# EAGLE design CANdiy-Shield_v21 (EAGLE 7.7.0)
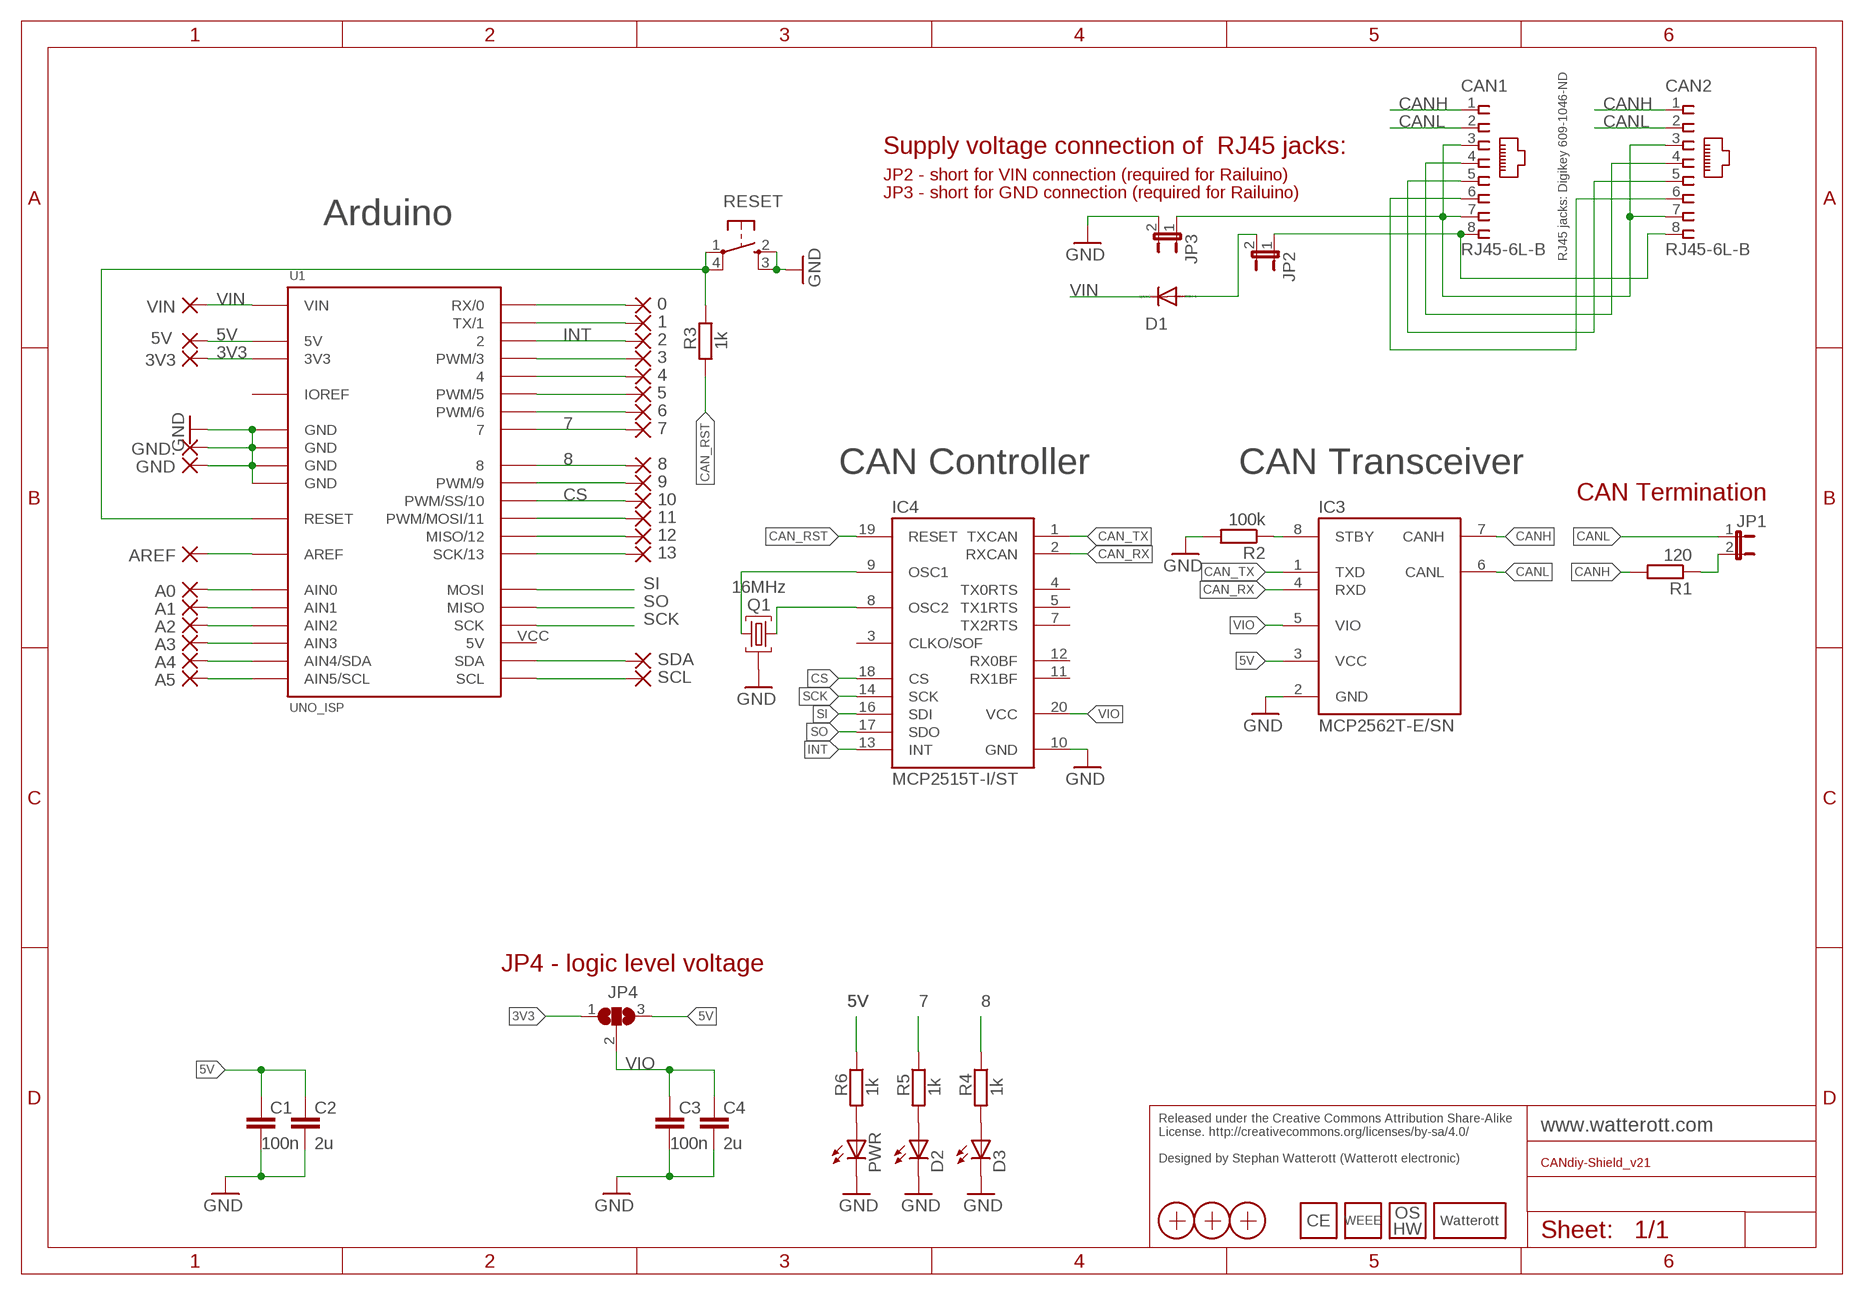
[diagram p0: schematic, sheet 1]

## Parts
0  1,6/0,8  [1,6/0,8]
1  1,6/0,8  [1,6/0,8]
2  1,6/0,8  [1,6/0,8]
3  1,6/0,8  [1,6/0,8]
3V3  1,6/0,8  [1,6/0,8]
4  1,6/0,8  [1,6/0,8]
5  1,6/0,8  [1,6/0,8]
5V  1,6/0,8  [1,6/0,8]
6  1,6/0,8  [1,6/0,8]
7  1,6/0,8  [1,6/0,8]
8  1,6/0,8  [1,6/0,8]
9  1,6/0,8  [1,6/0,8]
10  1,6/0,8  [1,6/0,8]
11  1,6/0,8  [1,6/0,8]
12  1,6/0,8  [1,6/0,8]
13  1,6/0,8  [1,6/0,8]
A0  1,6/0,8  [1,6/0,8]
A1  1,6/0,8  [1,6/0,8]
A2  1,6/0,8  [1,6/0,8]
A3  1,6/0,8  [1,6/0,8]
A4  1,6/0,8  [1,6/0,8]
A5  1,6/0,8  [1,6/0,8]
AREF  1,6/0,8  [1,6/0,8]
C1  100n  C-EUC0603  [C0603]
C2  2u  C-EUC0603  [C0603]
C3  100n  C-EUC0603  [C0603]
C4  2u  C-EUC0603  [C0603]
CAN1  RJ45-6L-B  [RJ45-NO-SHIELD]
CAN2  RJ45-6L-B  [RJ45-NO-SHIELD]
D1  CGRM4001-G  [SOD-123_MINI-SMA]
D2  LEDCHIPLED_0603  [CHIPLED_0603]
D3  LEDCHIPLED_0603  [CHIPLED_0603]
GND  1,6/0,8  [1,6/0,8]
GND.  1,6/0,8  [1,6/0,8]
IC3  MCP2562T-E/SN  [SO08]
IC4  MCP2515T-I/ST  [TSSOP20]
JP1  JP1E  [JP1]
JP2  JP1E  [JP1]
JP3  JP1E  [JP1]
JP4  SJ2W  [SJ_2]
LOGO3  LOGO-9  [LOGO_9MM]
LOGO4  LOGO_CE-2  [CE_2MM]
LOGO5  LOGO_OSHW-3  [OSHW_3MM]
LOGO6  LOGO_WEEE-4  [WEEE_4MM]
PWR  LEDCHIPLED_0603  [CHIPLED_0603]
Q1  16MHz  CRYSTAL-RES-32  [CRYSTAL_32X13]
R1  120  R-EU_R0603  [R0603]
R2  100k  R-EU_R0603  [R0603]
R3  1k  R-EU_R0603  [R0603]
R4  1k  R-EU_R0603  [R0603]
R5  1k  R-EU_R0603  [R0603]
R6  1k  R-EU_R0603  [R0603]
RESET  SW_SMDS  [SW_SMD4]
SCL  1,6/0,8  [1,6/0,8]
SDA  1,6/0,8  [1,6/0,8]
U1  UNO_ISP  [UNO_ISP]
VIN  1,6/0,8  [1,6/0,8]
X1  PASSER-07  [PASSER_07MM]
X2  PASSER-07  [PASSER_07MM]
X3  PASSER-07  [PASSER_07MM]

## Nets
0: 0.1(P) U1.0(RX/0)
1: 1.1(P) U1.1(TX/1)
3: 3.1(P) U1.3(PWM/3)
3V3: 3V3.1(P) JP4.1 U1.3V3
4: 4.1(P) U1.4
5: 5.1(P) U1.5(PWM/5)
5V: 5V.1(P) C1.1 C2.1 IC3.3(VCC) JP4.3 R6.1 U1.5V
6: 6.1(P) U1.6(PWM/6)
7: 7.1(P) R5.1 U1.7
8: 8.1(P) R4.1 U1.8
9: 9.1(P) U1.9(PWM/9)
11: 11.1(P) U1.11(PWM/MOSI/11)
12: 12.1(P) U1.12(MISO/12)
13: 13.1(P) U1.13(SCK/13)
A0: A0.1(P) U1.AIN0
A1: A1.1(P) U1.AIN1
A2: A2.1(P) U1.AIN2
A3: A3.1(P) U1.AIN3
A4: A4.1(P) U1.AIN4(AIN4/SDA)
A5: A5.1(P) U1.AIN5(AIN5/SCL)
AREF: AREF.1(P) U1.AREF
CAN_RST: IC4.19(RESET) R3.2
CAN_RX: IC3.4(RXD) IC4.2(RXCAN)
CAN_TX: IC3.1(TXD) IC4.1(TXCAN)
CANH: CAN1.1 CAN2.1 IC3.7(CANH) R1.2
CANL: CAN1.2 CAN2.2 IC3.6(CANL) JP1.1
CS: 10.1(P) IC4.18(CS) U1.10(PWM/SS/10)
GND: C1.2 C2.2 C3.2 C4.2 D2.C D3.C GND.1(P) GND..1(P) IC3.2(GND) IC4.10(GND) JP3.2 PWR.C Q1.GND R2.2 RESET.2(S) RESET.3(S1) U1.GND@1(GND) U1.GND@2(GND) U1.GND@3(GND) U1.GND@4(GND)
INT: 2.1(P) IC4.13(INT) U1.2
N$6: CAN1.8 CAN2.8 JP2.1
N$7: IC3.8(STBY) R2.1
N$8: CAN1.3 CAN1.7 CAN2.3 CAN2.7 JP3.1
N$9: JP1.2 R1.1
N$18: SCL.1(P) U1.SCL
N$19: SDA.1(P) U1.SDA
N$21: D3.A R4.2
N$22: PWR.A R6.2
N$23: D2.A R5.2
N$121: D1.A JP2.2
N$199: CAN1.4 CAN2.4
N$200: CAN1.5 CAN2.5
N$201: CAN1.6 CAN2.6
OSC1: IC4.9(OSC1) Q1.2
OSC2: IC4.8(OSC2) Q1.1
RESET: R3.1 RESET.1(P) RESET.4(P1) U1.RST(RESET)
SCK: IC4.14(SCK) U1.SCK
SI: IC4.16(SDI) U1.MOSI
SO: IC4.17(SDO) U1.MISO
VIN: D1.C U1.VIN VIN.1(P)
VIO: C3.1 C4.1 IC3.5(VIO) IC4.20(VCC) JP4.2
Unconnected: IC4.3(CLKO/SOF) IC4.4(TX0RTS) IC4.5(TX1RTS) IC4.7(TX2RTS) IC4.11(RX1BF) IC4.12(RX0BF) U1.VCC(5V)

## Notes on the sheet
- Supply voltage connection of  RJ45 jacks:
- JP2 - short for VIN connection (required for Railuino)
- JP3 - short for GND connection (required for Railuino)
- Arduino
- RJ45 jacks: Digikey 609-1046-ND
- CAN Controller | CAN Transceiver
- CAN Termination
- JP4 - logic level voltage
- Released under the Creative Commons Attribution Share-Alike 
  License. http://creativecommons.org/licenses/by-sa/4.0/
  
  Designed by Stephan Watterott (Watterott electronic)

## Power pins joined to a net without a drawn wire
IOREF: U1.IOREF

## Library data of the parts
0 1-3 3V3 4 5 5V 6-13 A0 A1-A5 AREF GND GND. SCL SDA VIN = wirepad:1,6/0,8: THROUGH-HOLE PAD
C1-C4 = resistor:C-EU: CAPACITOR, European symbol
CAN1 CAN2 = con-tycoelectronics:RJ45: CORCOM Modular RJ Jacks No Shield Source: www.tycoelectronics.com .. ENG_DS_1654001_1099_RJ_L_0507.pdf; MPN: RJ45-6L-B; OC_FARNELL: unknown; OC_NEWARK: 16R6090
D1 = diode:CGRM400*-G: Molded plasitc,JEDEC SOD-123/Mini SMA Source: Comchip CGRM4001-G.pdf
D2 D3 PWR = led:LED: LED OSRAM: - CHIPLED LG R971, LG N971, LY N971, LG Q971, LY Q971, LO R971, LY R971 LH N974, LH R974 LS Q976, LO Q976, LY Q976 LO Q996 - Hyper CHIPLED LW Q18S LB Q993, LB Q99A, LB R99A - SideLED LS A670, LO A670, LY A670, LG A670, LP A670 LB A673, LV A673, LT A673, LW A673 LH A674 LY A675 LS A676, LA A676, LO A676, LY A676, LW A676 LS A679, LY A679, LG A679 - Hyper Micro SIDELED® LS Y876, LA Y876, LO Y876, LY Y876 LT Y87S - SmartLED LW L88C, LW L88S LB L89C, LB L89S, LG L890 LS L89K, LO L89K, LY L89K LS L896, LA L896, LO L896, LY L896 - TOPLED LS T670, LO T670, LY T670, LG T670, LP T670 LSG T670, LSP T670, LSY T670, LOP T670, LYG T670 LG T671, LOG T671, LSG T671 LB T673, LV T673, LT T673, LW T673 LH T674 LS T676, LA T676, LO T676, LY T676, LB T676, LH T676, LSB T676, LW T676 LB T67C, LV T67C, LT T67C, LS T67K, LO T67K, LY T67K, LW E67C LS E67B, LA E67B, LO E67B, LY E67B, LB E67C, LV E67C, LT E67C LW T67C LS T679, LY T679, LG T679 LS T770, LO T770, LY T770, LG T770, LP T770 LB T773, LV T773, LT T773, LW T773 LH T774 LS E675, LA E675, LY E675, LS T675 LS T776, LA T776, LO T776, LY T776, LB T776 LHGB T686 LT T68C, LB T68C - Hyper Mini TOPLED® LB M676 - Mini TOPLED Santana® LG M470 LS M47K, LO M47K, LY M47K Source: http://www.osram.convergy.de LUXEON: - LUMILED® LXK2-PW12-R00, LXK2-PW12-S00, LXK2-PW14-U00, LXK2-PW14-V00 LXK2-PM12-R00, LXK2-PM12-S00, LXK2-PM14-U00 LXK2-PE12-Q00, LXK2-PE12-R00, LXK2-PE12-S00, LXK2-PE14-T00, LXK2-PE14-U00 LXK2-PB12-K00, LXK2-PB12-L00, LXK2-PB12-M00, LXK2-PB14-N00, LXK2-PB14-P00, LXK2-PB14-Q00 LXK2-PR12-L00, LXK2-PR12-M00, LXK2-PR14-Q00, LXK2-PR14-R00 LXK2-PD12-Q00, LXK2-PD12-R00, LXK2-PD12-S00 LXK2-PH12-R00, LXK2-PH12-S00 LXK2-PL12-P00, LXK2-PL12-Q00, LXK2-PL12-R00 Source: www.luxeon.com KINGBRIGHT: KA-3528ASYC Source: www.kingbright.com
IC3 = we-chip:MCP2562: Microchip MCP2562/MCP2562FD CAN Transceiver
IC4 = we-chip:MCP2515: Microchip MCP2515 CAN Controller
JP1-JP3 = jumper:JP1E: JUMPER
JP4 = jumper:SJ2W: SMD solder JUMPER
LOGO3 = we-symbol:LOGO: Watterott electronic Logo
LOGO4 = we-symbol:LOGO_CE: CE Logo
LOGO5 = we-symbol:LOGO_OSHW: Open-Source-Hardware Logo
LOGO6 = we-symbol:LOGO_WEEE: WEEE Logo
Q1 = we-rcl:CRYSTAL-RES: Crystal Resonator Murata CSTCR (Size: 4.5mm x 2.0mm) Tolerance: 0.5% 4MHz 15pF CST-CR-4M00-G53 4MHz 39pF CST-CR-4M00-G55 Tolerance: 0.1% 4MHz 39pF CST-CR-4M00-G15 Murata CSTE (Size: 3.2mm x 1.3mm) Tolerance: 0.5% 8MHz 33pF CST-CE-8M00-G55 12MHz 33pF CST-CE-12M0-G55 16MHz 15pF CST-CE-16M0-V53 20MHz 15pF CST-CE-20M0-V53 Tolerance: 0.1% 8MHz 33pF CST-CE-8M00-G15 12MHz 33pF CST-CE-12M0-G15 16MHz 15pF CST-CE-16M0-V13 20MHz 15pF CST-CE-20M0-V13
R1 R2 = resistor:R-EU_: RESISTOR, European symbol
R3-R6 = rcl:R-EU_: RESISTOR, European symbol
RESET = Switch-SMD:SW_SMD
U1 = Arduino:UNO_ISP
X1-X3 = we-symbol:PASSER: Fiducial Marker

## Board
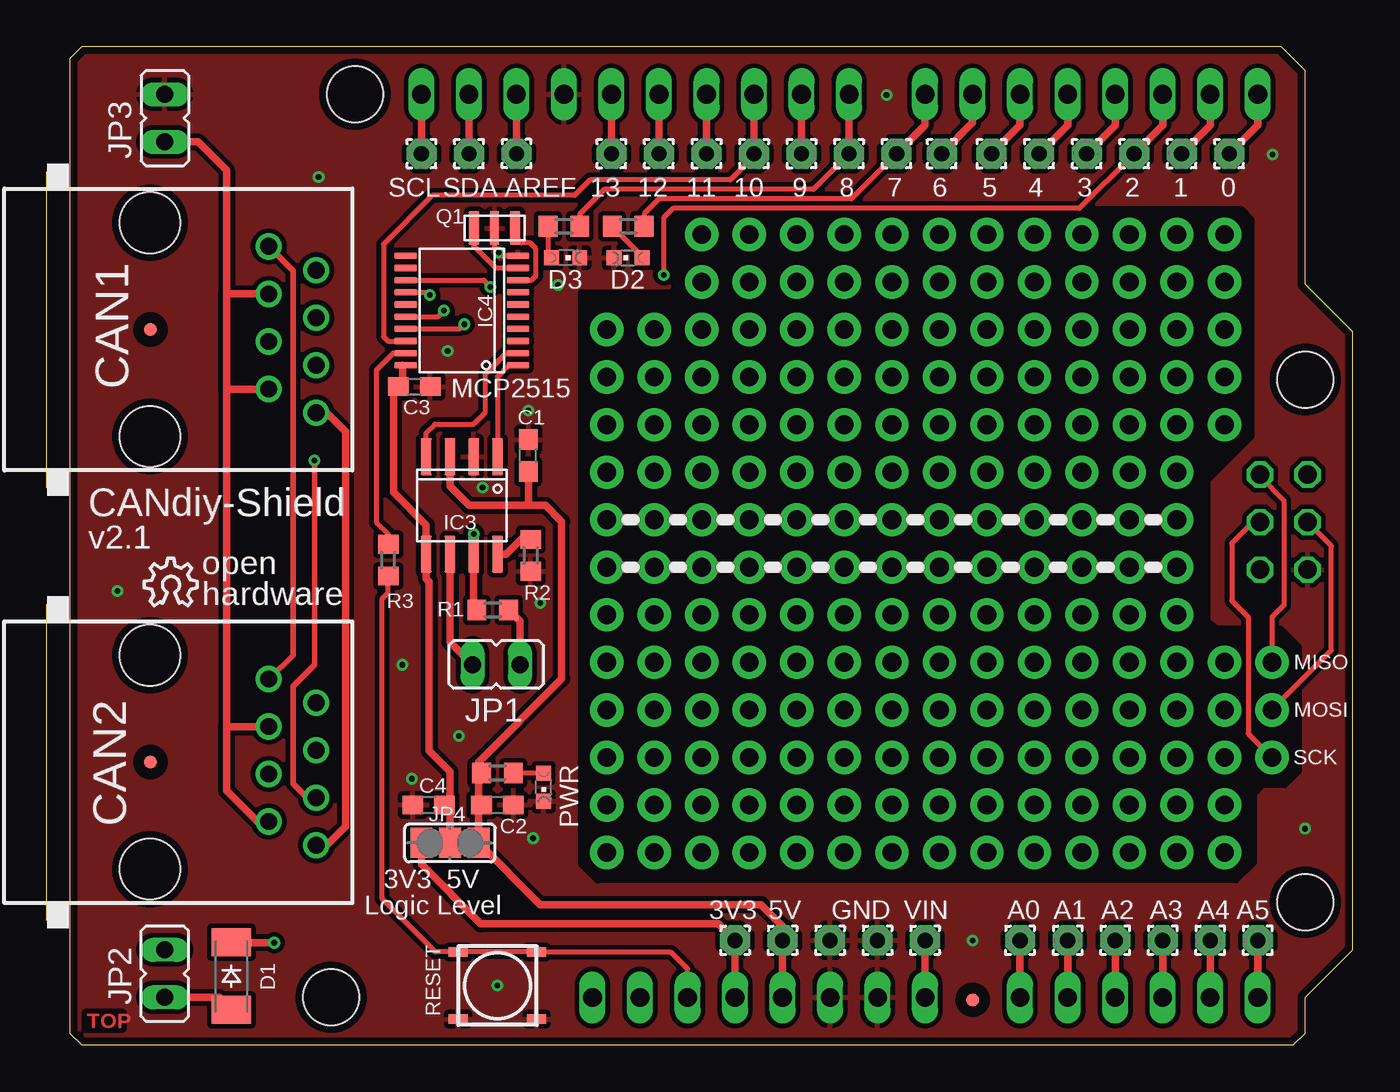
[diagram p1: board, top side]
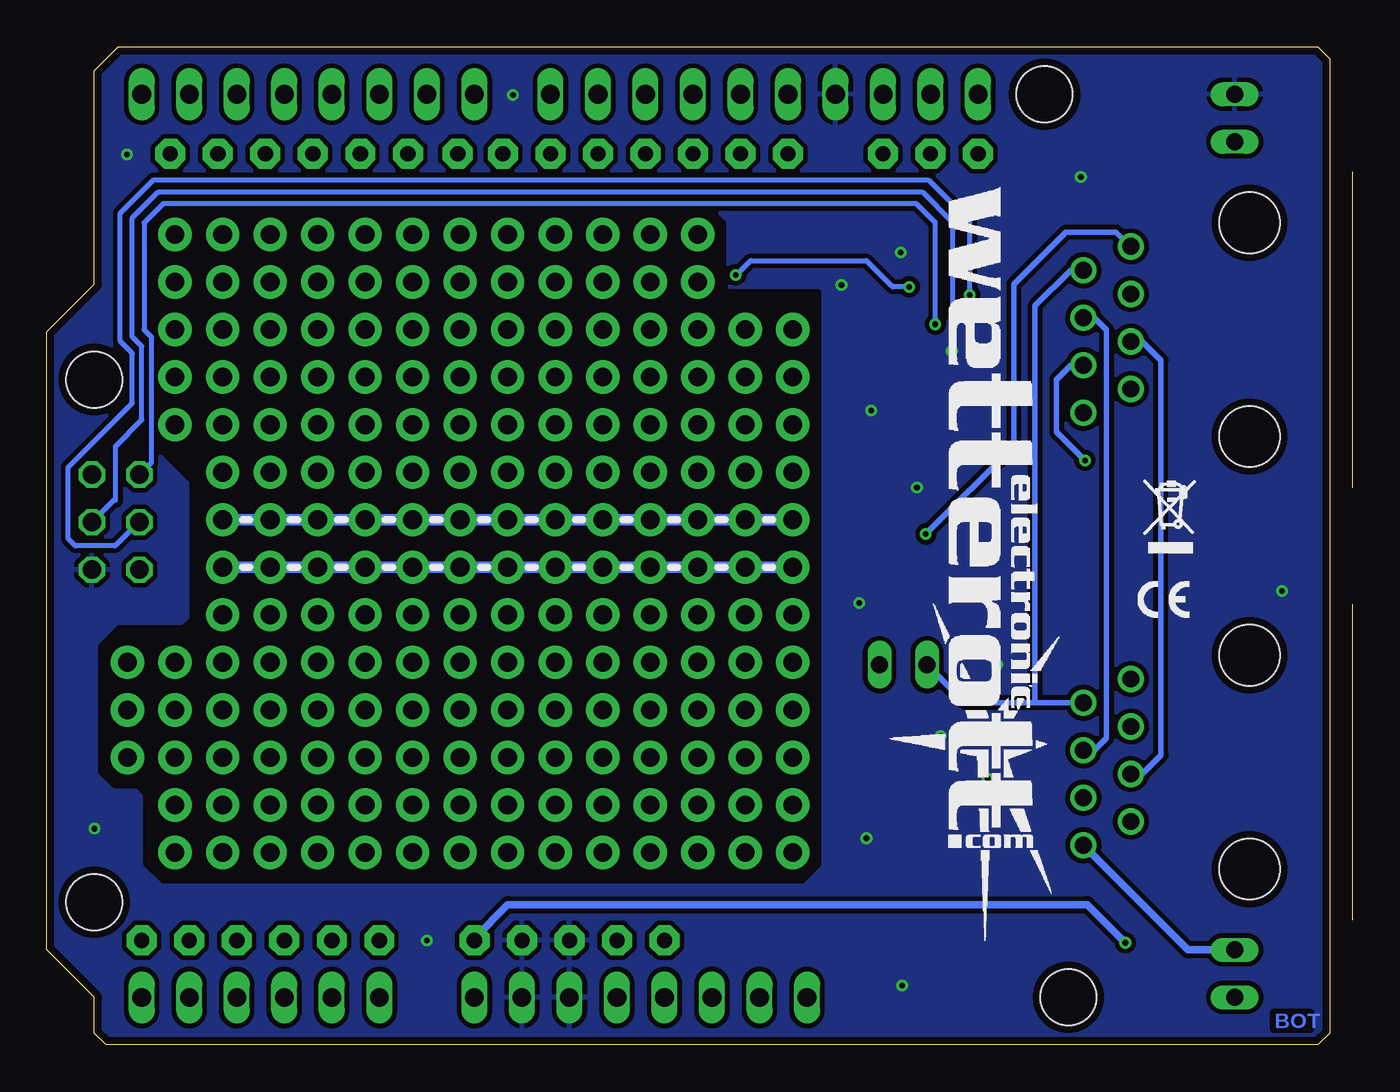
[diagram p2: board, bottom side, seen from below]

Size 69.81 x 53.34 mm. Coordinates in mm from the lower left corner, seen from the top.
Copper layers (1*16): Top 0.035mm / dielectric 1.5mm / Bottom 0.035mm
Design rules "we-dru-2-layer": minimum track width 0.15mm, minimum drill 0.3mm, track to track 0.15mm, track to pad 0.15mm, pad to pad 0.15mm, via to via 0.15mm, smd to smd 0.1mm, copper to edge 0.4mm, drill to drill 0.2mm, minimum pad ring 0.18mm, minimum via ring 0.16mm, stop-mask expansion 0.1mm, vias tented up to drill 0.5mm, thermal gap 0.25mm

### Footprints (pad centres in the part's own frame; a part is rotated, then mirrored left to right if it is on the bottom)
1,6/0,8 = drill 0.813 pad 1.6 octagon: 1 0,0
C0603 = smd 1.1 x 1: 1 -0.85,0; 2 0.85,0
RJ45-NO-SHIELD = drill 0.9 pad 1.4: 1 -4.445,6.35; 2 -3.175,8.89; 3 -1.905,6.35; 4 -0.635,8.89; 5 0.635,6.35; 6 1.905,8.89; 7 3.175,6.35; 8 4.445,8.89 | hole 3.251: -5.715,0; 5.715,0
SOD-123_MINI-SMA = smd 1.5 x 2.1: A 1.8,0; C -1.8,0
CHIPLED_0603 = smd 0.8 x 0.8: A 0,-0.75; C 0,0.75
SO08 = smd 2 x 0.6: 1 -2.6,1.905; 2 -2.6,0.635; 3 -2.6,-0.635; 4 -2.6,-1.905; 5 2.6,-1.905; 6 2.6,-0.635; 7 2.6,0.635; 8 2.6,1.905
TSSOP20 = smd 1.2 x 0.35: 1 -3,2.925; 2 -3,2.275; 3 -3,1.625; 4 -3,0.975; 5 -3,0.325; 6 -3,-0.325; 7 -3,-0.975; 8 -3,-1.625; 9 -3,-2.275; 10 -3,-2.925; 11 3,-2.925; 12 3,-2.275; 13 3,-1.625; 14 3,-0.975; 15 3,-0.325; 16 3,0.325; 17 3,0.975; 18 3,1.625; 19 3,2.275; 20 3,2.925
JP1 = drill 0.914 long: 1 0,-1.27; 2 0,1.27
SJ_2 = smd 1.168 x 1.6: 1 -1.524,0; 2 0,0; 3 1.524,0
CRYSTAL_32X13 = smd 1.8 x 0.6: 1 0,1.1; 2 0,-1.1 | smd 1.8 x 0.5: GND 0,0
R0603 = smd 1 x 1.1: 1 -0.85,0; 2 0.85,0
SW_SMD4 = smd 0.508 x 1.016: 1 -1.8,-2.1; 2 1.8,-2.1; 3 1.8,2.1; 4 -1.8,2.1
UNO_ISP = drill 1 long: 0 63.5,50.8; 1 60.96,50.8; 2 58.42,50.8; 3 55.88,50.8; 3V3 35.56,2.54; 4 53.34,50.8; 5 50.8,50.8; 5V 38.1,2.54; 6 48.26,50.8; 7 45.72,50.8; 8 41.656,50.8; 9 39.116,50.8; 10 36.576,50.8; 11 34.036,50.8; 12 31.496,50.8; 13 28.956,50.8; AIN0 50.8,2.54; AIN1 53.34,2.54; AIN2 55.88,2.54; AIN3 58.42,2.54; AIN4 60.96,2.54; AIN5 63.5,2.54; AREF 23.876,50.8; GND@1 40.64,2.54; GND@2 43.18,2.54; GND@3 26.416,50.8; IOREF 30.48,2.54; NC 27.94,2.54; RST 33.02,2.54; SCL 18.796,50.8; SDA 21.336,50.8; VIN 45.72,2.54 | drill 1 octagon: GND@4 66.167,25.4; MISO 63.627,30.48; MOSI 66.167,27.94; RST2 63.627,25.4; SCK 63.627,27.94; VCC 66.167,30.48 | hole 3: 66.04,35.56; 66.04,7.62; 15.24,50.8; 13.97,2.54
PASSER_07MM = smd 0.7 x 0.7: X 0,0

### Placement (x,y rotation side)
0  63.21,47.62 180 top
1  60.67,47.62 180 top
2  58.13,47.62 180 top
3  55.59,47.62 180 top
3V3  36.79,5.59 0 top
4  53.05,47.62 180 top
5  50.51,47.62 180 top
5V  39.33,5.59 0 top
6  47.84,47.62 180 top
7  45.43,47.62 180 top
8  42.89,47.62 180 top
9  40.35,47.62 180 top
10  37.81,47.62 180 top
11  35.27,47.62 180 top
12  32.73,47.62 180 top
13  30.19,47.62 180 top
A0  52.03,5.59 0 top
A1  54.57,5.59 0 top
A2  57.11,5.59 0 top
A3  59.65,5.59 0 top
A4  62.19,5.59 0 top
A5  64.73,5.59 0 top
AREF  25.11,47.62 0 top
C1  25.74,31.5 90 top
C2  24.09,12.83 0 top
C3  19.65,35.18 0 top
C4  20.41,12.83 180 top
CAN1  5.51,38.23 270 top
CAN2  5.51,15.11 270 top
D1  9.87,3.68 270 top
D2  31.08,42.07 90 top
D3  27.74,42.07 270 top
GND  41.87,5.59 0 top
GND.  44.41,5.59 0 top
IC3  22.19,28.83 270 top
IC4  22.19,39.24 180 top
JP1  24.03,20.32 270 top
JP2  6.31,3.81 180 top
JP3  6.31,49.53 0 top
JP4  21.55,10.79 0 top
LOGO3  24.73,45.72 270 bottom
LOGO4  10.12,23.81 0 bottom
LOGO5  6.63,24.77 0 top
LOGO6  9.8,28.26 0 bottom
PWR  26.57,13.78 180 top
Q1  23.93,43.66 270 top
R1  23.84,23.24 180 top
R2  25.87,26.16 270 top
R3  18.25,25.91 90 top
R4  27.65,43.75 180 top
R5  31.08,43.75 180 top
R6  24.09,14.54 0 top
RESET  24.09,3.17 270 top
SCL  20.03,47.62 180 top
SDA  22.57,47.62 180 top
U1  1.23,0 0 top
VIN  46.95,5.59 0 top
X1  5.55,15.11 0 top
X2  5.55,38.23 0 top
X3  49.49,2.41 0 top

### Tracks (layer width: path | path; a pad name or v marks a point on that pad's centre or on a via)
0
  Top 0.406: U1.0 64.73,49.15 0.1
1
  Top 0.406: U1.1 62.19,49.15 1.1
3
  Top 0.406: U1.3 57.11,49.15 3.1
3V3
  Top 0.406: U1.3V3 3V3.1 35.9,6.48 23.2,6.48 20.03,9.65 JP4.1
4
  Top 0.406: U1.4 54.57,49.15 4.1
5
  Top 0.406: U1.5 52.03,49.15 5.1
5V
  Top 0.254: 23.08,12.66 C2.1 23.08,12.83 | 23.08,14.38 R6.1 23.14,14.54 23.08,14.61
  Top 0.406: U1.5V 5V.1 39.33,6.35 38.19,7.49 26.38,7.49 JP4.3 23.08,12.66 | 25.74,28.83 22.57,28.83 21.55,29.84 IC3.3 | 25.74,28.83 26.66,28.83 27.52,27.97 27.52,19.56 23.08,15.11 23.08,14.61 | C1.1 25.74,28.83 | 23.08,12.83 23.08,14.38
6
  Top 0.406: U1.6 49.49,49.28 6.1
7
  Top 0.254: 7.1 43.01,45.21 32.73,45.21 31.93,44.41 R5.1
  Top 0.406: U1.7 46.95,49.15 7.1
8
  Top 0.254: 8.1 40.98,45.72 29.81,45.72 28.5,44.41 R4.1
  Top 0.406: U1.8 8.1
9
  Top 0.406: U1.9 9.1
11
  Top 0.406: 11.1 U1.11
12
  Top 0.406: 12.1 U1.12
13
  Top 0.406: 13.1 U1.13
A0
  Top 0.406: U1.AIN0 A0.1
A1
  Top 0.406: U1.AIN1 A1.1
A2
  Top 0.406: U1.AIN2 A2.1
A3
  Top 0.406: U1.AIN3 A3.1
A4
  Top 0.406: U1.AIN4 A4.1
A5
  Top 0.406: U1.AIN5 A5.1
AREF
  Top 0.406: AREF.1 U1.AREF
CAN_RST
  Top 0.254: R3.2 18.25,27.3 17.61,27.94 17.61,36.07 18.51,36.97 IC4.19
CAN_RX
  Top 0.254: IC4.2 24.55,36.97 23.46,35.88 23.46,33.81 22.82,33.18 20.76,33.18 20.28,32.7 IC3.4
CAN_TX
  Top 0.254: IC3.1 24.09,35.72 24.69,36.32 IC4.1
CANH  (via drill 0.3)
  Top 0.254: CAN2.1 11.9,19.56 | IC3.7 v22.82,27.3
  Top 0.305: 22.82,23.41 R1.2 | 11.9,19.56 13.17,20.83 13.17,41.36 CAN1.1
  Top 0.406: IC3.7 22.82,23.41
  Bottom 0.254: CAN1.1 11.9,42.67
  Bottom 0.305: 11.9,42.67 12.66,43.43 15.33,43.43 18.12,40.64 18.12,32 v22.82,27.3
CANL
  Top 0.406: JP1.1 21.55,21.53 IC3.6
  Bottom 0.305: CAN2.2 16.98,18.29 | 16.98,18.29 20.73,18.29 JP1.1 | CAN1.2 15.07,41.4 16.98,39.5 16.98,18.29
CS
  Top 0.254: 10.1 37.81,47.5 36.54,46.23 29.04,46.23 28.22,45.4 20.6,45.4 18,42.8 18,37.85 18.25,37.59 19.21,37.59 | 19.24,37.59 19.21,37.59 | 19.21,37.59 IC4.18
  Top 0.406: U1.10 10.1
GND  (via drill 0.3)
  Top 0.254: IC4.10 24.34,42.17 v24.16,42.35 23.93,42.58 Q1.GND
  other vias: 23.3,29.78 21.42,37.08 24.09,3.17 26.38,23.62 25.74,33.91 67.27,11.56 19.52,14.22 26,11.05 3.77,24.26 49.49,5.59 65.53,47.59 14.54,46.39 44.89,50.77 27.33,40.61 19.01,20.32 22.03,16.51
  pour Bottom (isolate 0.254): 1.23,53.34 69.81,53.34 69.81,0 1.23,0
  pour Top (isolate 0.254): 1.23,0 1.23,53.34 69.81,53.34 69.81,0
INT  (via drill 0.3)
  Top 0.254: 2.1 55.21,44.7 33.49,44.7 32.98,44.2 v32.98,41.15 | v23.71,40.51 23.36,40.87 IC4.13
  Top 0.406: U1.2 59.65,49.15 2.1
  Bottom 0.254: v32.98,41.15 32.95,41.15 32.19,41.91 26,41.91 24.6,40.51 v23.71,40.51
N$2  (via drill 1 pad 1.78)
  other vias: 32.47,15.37
N$3  (via drill 1 pad 1.78)
  other vias: 29.93,15.37
N$4  (via drill 1 pad 1.78)
  other vias: 32.47,12.83
N$5  (via drill 1 pad 1.78)
  other vias: 29.93,12.83
N$6
  Top 0.406: CAN2.8 14.95,10.67 15.96,11.68 15.96,32.77 14.95,33.78 CAN1.8
  Bottom 0.406: JP2.1 8.81,5.08 CAN2.8
N$7
  Top 0.406: R2.1 25.35,27.01 24.56,26.23 IC3.8
N$8
  Top 0.406: JP3.1 8.09,48.26 9.61,46.74 9.61,40.13 | 9.61,40.13 CAN1.3 | 9.61,35.05 9.61,40.13 | CAN1.7 9.61,35.05 | 9.61,35.05 9.61,17.02 | 9.61,17.02 CAN2.3 | CAN2.7 11.26,11.94 9.61,13.59 9.61,17.02
N$9
  Top 0.406: JP1.2 25.3,22.63 R1.1
N$10  (via drill 1 pad 1.78)
  other vias: 60.41,35.69
N$11  (via drill 1 pad 1.78)
  other vias: 57.87,35.69
N$12  (via drill 1 pad 1.78)
  other vias: 55.33,35.69
N$14  (via drill 1 pad 1.78)
  other vias: 52.79,35.69
N$15  (via drill 1 pad 1.78)
  other vias: 50.25,35.69
N$16  (via drill 1 pad 1.78)
  other vias: 47.71,35.69
N$17  (via drill 1 pad 1.78)
  other vias: 45.17,35.69
N$18
  Top 0.406: SCL.1 U1.SCL
N$19
  Top 0.406: SDA.1 U1.SDA
N$20  (via drill 1 pad 1.78)
  other vias: 42.63,38.23
N$21
  Top 0.254: R4.2 26.8,42.26 D3.A
N$22
  Top 0.254: R6.2 26.56,14.54 PWR.A
N$23
  Top 0.254: D2.A 31.83,42.15 R5.2
N$24  (via drill 1 pad 1.78)
  other vias: 42.63,10.29
N$25  (via drill 1 pad 1.78)
  other vias: 42.63,35.69
N$26  (via drill 1 pad 1.78)
  other vias: 62.95,38.23
N$27  (via drill 1 pad 1.78)
  other vias: 60.41,38.23
N$28  (via drill 1 pad 1.78)
  other vias: 57.87,38.23
N$29  (via drill 1 pad 1.78)
  other vias: 55.33,38.23
N$30  (via drill 1 pad 1.78)
  other vias: 52.79,38.23
N$31  (via drill 1 pad 1.78)
  other vias: 50.25,38.23
N$32  (via drill 1 pad 1.78)
  other vias: 47.71,38.23
N$33  (via drill 1 pad 1.78)
  other vias: 45.17,38.23
N$34  (via drill 1 pad 1.78)
  other vias: 42.63,33.15
N$35  (via drill 1 pad 1.78)
  other vias: 42.63,30.61
N$37  (via drill 1 pad 1.78)
  other vias: 62.95,40.77
N$38  (via drill 1 pad 1.78)
  other vias: 60.41,40.77
N$39  (via drill 1 pad 1.78)
  other vias: 57.87,40.77
N$40  (via drill 1 pad 1.78)
  other vias: 55.33,40.77
N$41  (via drill 1 pad 1.78)
  other vias: 62.95,20.45
N$42  (via drill 1 pad 1.78)
  other vias: 62.95,10.29
N$43  (via drill 1 pad 1.78)
  other vias: 60.41,10.29
N$44  (via drill 1 pad 1.78)
  other vias: 57.87,10.29
N$45  (via drill 1 pad 1.78)
  other vias: 55.33,10.29
N$46  (via drill 1 pad 1.78)
  other vias: 52.79,10.29
N$47  (via drill 1 pad 1.78)
  other vias: 50.25,10.29
N$48  (via drill 1 pad 1.78)
  other vias: 47.71,10.29
N$49  (via drill 1 pad 1.78)
  other vias: 45.17,10.29
N$50  (via drill 1 pad 1.78)
  other vias: 52.79,40.77
N$51  (via drill 1 pad 1.78)
  other vias: 50.25,40.77
N$52  (via drill 1 pad 1.78)
  other vias: 47.71,40.77
N$53  (via drill 1 pad 1.78)
  other vias: 45.17,40.77
N$55  (via drill 1 pad 1.78)
  other vias: 62.95,43.31
N$56  (via drill 1 pad 1.78)
  other vias: 60.41,43.31
N$57  (via drill 1 pad 1.78)
  other vias: 57.87,43.31
N$58  (via drill 1 pad 1.78)
  other vias: 55.33,43.31
N$59  (via drill 1 pad 1.78)
  other vias: 60.41,33.15
N$60  (via drill 1 pad 1.78)
  other vias: 57.87,33.15
N$61  (via drill 1 pad 1.78)
  other vias: 55.33,33.15
N$62  (via drill 1 pad 1.78)
  other vias: 52.79,33.15
N$63  (via drill 1 pad 1.78)
  other vias: 50.25,33.15
N$64  (via drill 1 pad 1.78)
  other vias: 47.71,33.15
N$65  (via drill 1 pad 1.78)
  other vias: 45.17,33.15
N$66  (via drill 1 pad 1.78)
  other vias: 52.79,43.31
N$67  (via drill 1 pad 1.78)
  other vias: 50.25,43.31
N$68  (via drill 1 pad 1.78)
  other vias: 47.71,43.31
N$69  (via drill 1 pad 1.78)
  other vias: 45.17,43.31
N$70  (via drill 1 pad 1.78)
  other vias: 42.63,22.99
N$71  (via drill 1 pad 1.78)
  other vias: 40.09,10.29
N$72  (via drill 1 pad 1.78)
  other vias: 62.95,17.91
N$73  (via drill 1 pad 1.78)
  other vias: 62.95,15.37
N$74  (via drill 1 pad 1.78)
  other vias: 62.95,12.83
N$75  (via drill 1 pad 1.78)
  other vias: 60.41,30.61
N$76  (via drill 1 pad 1.78)
  other vias: 57.87,30.61
N$77  (via drill 1 pad 1.78)
  other vias: 55.33,30.61
N$78  (via drill 1 pad 1.78)
  other vias: 52.79,30.61
N$79  (via drill 1 pad 1.78)
  other vias: 50.25,30.61
N$80  (via drill 1 pad 1.78)
  other vias: 47.71,30.61
N$81  (via drill 1 pad 1.78)
  other vias: 45.17,30.61
N$82  (via drill 1 pad 1.78)
  other vias: 42.63,20.45
N$83  (via drill 1 pad 1.78)
  other vias: 42.63,17.91
N$84  (via drill 1 pad 1.78)
  other vias: 42.63,15.37
N$85  (via drill 1 pad 1.78)
  other vias: 42.63,12.83
N$86  (via drill 1 pad 1.78)
  other vias: 32.47,10.29
N$87  (via drill 1 pad 1.78)
  other vias: 29.93,10.29
N$89  (via drill 1 pad 1.78)
  other vias: 37.55,10.29
N$90  (via drill 1 pad 1.78)
  other vias: 42.63,40.77
N$91
  cutout Top: 33.62,43.75 34.44,44.7 63.84,44.7 64.41,44.13 64.41,32.51 62.06,30.16 62.06,22.73 62.51,22.29 65.94,22.29 66.95,21.27 66.95,14.61 66.19,13.84 64.99,13.84 64.54,13.4 64.54,9.72 63.59,8.76 29.43,8.76 28.54,9.65 28.54,40.26 33.36,40.26 33.62,40.51 33.62,43.94
N$104  (via drill 1 pad 1.78)
  other vias: 42.63,43.31
N$119  (via drill 1 pad 1.78)
  other vias: 62.95,35.69
N$121
  Top 0.406: JP2.2 9.21,2.54 D1.A
N$122
  cutout Bottom: 33.62,43.88 34.44,44.7 63.84,44.7 64.41,44.13 64.41,32.51 62.06,30.16 62.06,22.73 62.51,22.29 65.94,22.29 66.95,21.27 66.95,14.61 66.19,13.84 64.99,13.84 64.54,13.4 64.54,9.72 63.59,8.76 29.43,8.76 28.54,9.65 28.54,40.26 33.36,40.26 33.62,40.51
N$123  (via drill 1 pad 1.78)
  other vias: 60.41,22.99
N$124  (via drill 1 pad 1.78)
  other vias: 57.87,22.99
N$125  (via drill 1 pad 1.78)
  other vias: 55.33,22.99
N$126  (via drill 1 pad 1.78)
  other vias: 52.79,22.99
N$127  (via drill 1 pad 1.78)
  other vias: 50.25,22.99
N$128  (via drill 1 pad 1.78)
  other vias: 47.71,22.99
N$129  (via drill 1 pad 1.78)
  other vias: 45.17,22.99
N$130  (via drill 1 pad 1.78)
  other vias: 40.09,38.23
N$131  (via drill 1 pad 1.78)
  other vias: 37.55,38.23
N$132  (via drill 1 pad 1.78)
  other vias: 40.09,35.69
N$133  (via drill 1 pad 1.78)
  other vias: 37.55,35.69
N$134  (via drill 1 pad 1.78)
  other vias: 40.09,33.15
N$135  (via drill 1 pad 1.78)
  other vias: 37.55,33.15
N$136  (via drill 1 pad 1.78)
  other vias: 40.09,30.61
N$137  (via drill 1 pad 1.78)
  other vias: 37.55,30.61
N$139  (via drill 1 pad 1.78)
  other vias: 60.41,20.45
N$140  (via drill 1 pad 1.78)
  other vias: 57.87,20.45
N$141  (via drill 1 pad 1.78)
  other vias: 55.33,20.45
N$142  (via drill 1 pad 1.78)
  other vias: 52.79,20.45
N$143  (via drill 1 pad 1.78)
  other vias: 50.25,20.45
N$144  (via drill 1 pad 1.78)
  other vias: 47.71,20.45
N$145  (via drill 1 pad 1.78)
  other vias: 45.17,20.45
N$147  (via drill 1 pad 1.78)
  other vias: 40.09,40.77
N$148  (via drill 1 pad 1.78)
  other vias: 37.55,40.77
N$149  (via drill 1 pad 1.78)
  other vias: 40.09,43.31
N$150  (via drill 1 pad 1.78)
  other vias: 37.55,43.31
N$151  (via drill 1 pad 1.78)
  other vias: 35.01,38.23
N$152  (via drill 1 pad 1.78)
  other vias: 35.01,35.69
N$153  (via drill 1 pad 1.78)
  other vias: 35.01,33.15
N$154  (via drill 1 pad 1.78)
  other vias: 35.01,30.61
N$155  (via drill 1 pad 1.78)
  other vias: 60.41,17.91
N$156  (via drill 1 pad 1.78)
  other vias: 57.87,17.91
N$157  (via drill 1 pad 1.78)
  other vias: 55.33,17.91
N$158  (via drill 1 pad 1.78)
  other vias: 52.79,17.91
N$159  (via drill 1 pad 1.78)
  other vias: 50.25,17.91
N$160  (via drill 1 pad 1.78)
  other vias: 47.71,17.91
N$161  (via drill 1 pad 1.78)
  other vias: 45.17,17.91
N$163  (via drill 1 pad 1.78)
  other vias: 35.01,40.77
N$164  (via drill 1 pad 1.78)
  other vias: 35.01,43.31
N$167  (via drill 1 pad 1.78)
  other vias: 40.09,22.99
N$168  (via drill 1 pad 1.78)
  other vias: 37.55,22.99
N$169  (via drill 1 pad 1.78)
  other vias: 40.09,20.45
N$171  (via drill 1 pad 1.78)
  other vias: 60.41,15.37
N$172  (via drill 1 pad 1.78)
  other vias: 57.87,15.37
N$173  (via drill 1 pad 1.78)
  other vias: 55.33,15.37
N$174  (via drill 1 pad 1.78)
  other vias: 52.79,15.37
N$175  (via drill 1 pad 1.78)
  other vias: 50.25,15.37
N$176  (via drill 1 pad 1.78)
  other vias: 47.71,15.37
N$177  (via drill 1 pad 1.78)
  other vias: 45.17,15.37
N$178  (via drill 1 pad 1.78)
  other vias: 37.55,20.45
N$179  (via drill 1 pad 1.78)
  other vias: 40.09,17.91
N$180  (via drill 1 pad 1.78)
  other vias: 37.55,17.91
N$181  (via drill 1 pad 1.78)
  other vias: 40.09,15.37
N$182  (via drill 1 pad 1.78)
  other vias: 37.55,15.37
N$183  (via drill 1 pad 1.78)
  other vias: 40.09,12.83
N$184  (via drill 1 pad 1.78)
  other vias: 37.55,12.83
N$185  (via drill 1 pad 1.78)
  other vias: 35.01,10.29
N$187  (via drill 1 pad 1.78)
  other vias: 60.41,12.83
N$188  (via drill 1 pad 1.78)
  other vias: 57.87,12.83
N$189  (via drill 1 pad 1.78)
  other vias: 55.33,12.83
N$190  (via drill 1 pad 1.78)
  other vias: 52.79,12.83
N$191  (via drill 1 pad 1.78)
  other vias: 50.25,12.83
N$192  (via drill 1 pad 1.78)
  other vias: 47.71,12.83
N$193  (via drill 1 pad 1.78)
  other vias: 45.17,12.83
N$194  (via drill 1 pad 1.78)
  other vias: 35.01,22.99
N$195  (via drill 1 pad 1.78)
  other vias: 35.01,20.45
N$196  (via drill 1 pad 1.78)
  other vias: 35.01,17.91
N$197  (via drill 1 pad 1.78)
  other vias: 35.01,15.37
N$198  (via drill 1 pad 1.78)
  other vias: 35.01,12.83
N$199
  Bottom 0.305: CAN1.4 13.8,38.86 13.17,38.23 13.17,16.38 13.8,15.75 CAN2.4
N$200
  Bottom 0.305: CAN2.5 11.26,14.48 10.25,15.49 10.25,36.58 11.26,37.59 CAN1.5
N$201  (via drill 0.3)
  Top 0.305: CAN2.6 13.93,13.21 13.17,13.97 13.17,19.18 14.31,20.32 v14.31,31.24
  Bottom 0.305: CAN1.6 15.07,36.32 15.84,35.56 15.84,32.77 v14.31,31.24
N$202  (via drill 1 pad 1.78)
  Top 0.61: v60.41,25.53 v55.33,25.53 v32.47,25.53 30.06,25.53
  Bottom 0.61: v29.93,25.53 v35.01,25.53 35.52,25.53 v37.55,25.53 v40.09,25.53 v42.63,25.53 v45.17,25.53 v47.71,25.53 v50.25,25.53 v52.79,25.53 v55.33,25.53 v57.87,25.53 v60.41,25.53
N$203  (via drill 1 pad 1.78)
  other vias: 32.47,38.23
N$204  (via drill 1 pad 1.78)
  other vias: 32.47,35.69
N$205  (via drill 1 pad 1.78)
  other vias: 32.47,33.15
N$206  (via drill 1 pad 1.78)
  other vias: 32.47,30.61
N$208  (via drill 1 pad 1.78)
  other vias: 29.93,38.23
N$209  (via drill 1 pad 1.78)
  other vias: 29.93,35.69
N$210  (via drill 1 pad 1.78)
  other vias: 29.93,33.15
N$211  (via drill 1 pad 1.78)
  other vias: 29.93,30.61
N$212  (via drill 1 pad 1.78)
  Top 0.61: v29.93,28.07 v47.71,28.07 | v47.71,28.07 v55.33,28.07 | v35.01,28.07 v47.71,28.07 | v60.41,28.07 55.84,28.07 v47.71,28.07
  Bottom 0.61: v29.93,28.07 v32.47,28.07 v35.01,28.07 v37.55,28.07 v40.09,28.07 v42.63,28.07 v45.17,28.07 v50.25,28.07 v52.79,28.07 | v52.79,28.07 v57.87,28.07 v60.41,28.07 | v52.79,28.07 50.76,28.07
N$214  (via drill 1 pad 1.78)
  other vias: 32.47,22.99
N$215  (via drill 1 pad 1.78)
  other vias: 32.47,20.45
N$216  (via drill 1 pad 1.78)
  other vias: 32.47,17.91
N$218  (via drill 1 pad 1.78)
  other vias: 29.93,22.99
N$219  (via drill 1 pad 1.78)
  other vias: 29.93,20.45
N$220  (via drill 1 pad 1.78)
  other vias: 29.93,17.91
N$2512  (via drill 1 pad 1.78)
  other vias: 62.95,33.15
OSC1
  Top 0.254: IC4.9 24.01,41.52 22.83,42.69 Q1.2
OSC2
  Top 0.254: IC4.8 25.91,40.87 26.16,41.12 26.16,42.55 25.84,42.86 25.36,42.86 25.04,43.18 25.04,43.65 Q1.1
RESET
  Top 0.254: U1.RST 34.25,4.06 33.36,4.95 26.21,4.95 RESET.4 | RESET.4 RESET.1 | RESET.4 20.77,4.97 17.93,7.81 17.93,23.84 18.22,24.13 18.22,25.06 R3.1
SCK  (via drill 0.3, 1 pad 1.78)
  Top 0.254: v65.49,15.37 64.22,16.64 64.22,22.86 63.33,23.75 63.33,26.8 64.48,27.94 U1.SCK | IC4.14 20.32,40.22 v20.47,40.07
  Bottom 0.254: U1.SCK 64.89,27.94 66.16,26.67 68.29,26.67 68.67,27.05 68.67,30.86 65.24,34.29 65.24,36.96 65.87,37.59 65.87,44.45 64.1,46.23 22.69,46.23 20.47,44.01 v20.47,40.07
SI  (via drill 0.3, 1 pad 1.78)
  Top 0.254: v65.49,17.91 68.67,21.08 68.67,26.67 U1.MOSI | IC4.16 20.91,38.92 v21.23,39.24
  Bottom 0.254: U1.MOSI 66.26,29.08 66.13,29.08 66.13,32 64.73,33.4 64.73,37.34 65.24,37.85 65.24,44.2 63.84,45.59 23.01,45.59 21.39,43.97 21.39,39.4 v21.23,39.24
SO  (via drill 0.3, 1 pad 1.78)
  Top 0.254: v65.49,20.45 65.49,22.86 66.13,23.5 66.13,29.08 64.86,30.35 U1.MISO | IC4.17 22.07,38.27 v22.31,38.51
  Bottom 0.254: U1.MISO 64.22,31.11 64.22,37.85 64.6,38.23 64.6,43.94 63.59,44.96 23.33,44.96 22.31,43.94 v22.31,38.51
VIN  (via drill 0.3)
  Top 0.406: U1.VIN VIN.1 | v12.15,5.46 9.89,5.46 D1.C
  Bottom 0.254: 46.95,5.71 VIN.1
  Bottom 0.406: 46.95,5.71 45.17,7.49 14.19,7.49 v12.15,5.46
VIO
  Top 0.254: C4.1 21.26,12.91 21.42,13.08 21.42,12.95 21.55,12.83 | IC4.20 19.02,36.32 19.01,36.32
  Top 0.406: JP4.2 21.55,12.53 C4.1 | 21.55,12.83 21.55,14.61 20.44,15.72 20.44,24.77 20.28,24.92 IC3.5 20.28,27.78 18.54,29.53 18.54,34.92 C3.1 19.02,35.4 19.02,36.32

### Text on the board
Top: TOP
Bottom: BOT
tPlace: MCP2515 | CANdiy-Shield | v2.1 | open | hardware | MISO | MOSI | SCK | 3V3 5V | Logic Level | 5V | GND
Reference: Silkscreen: 21 tPlace + 22 bPlace